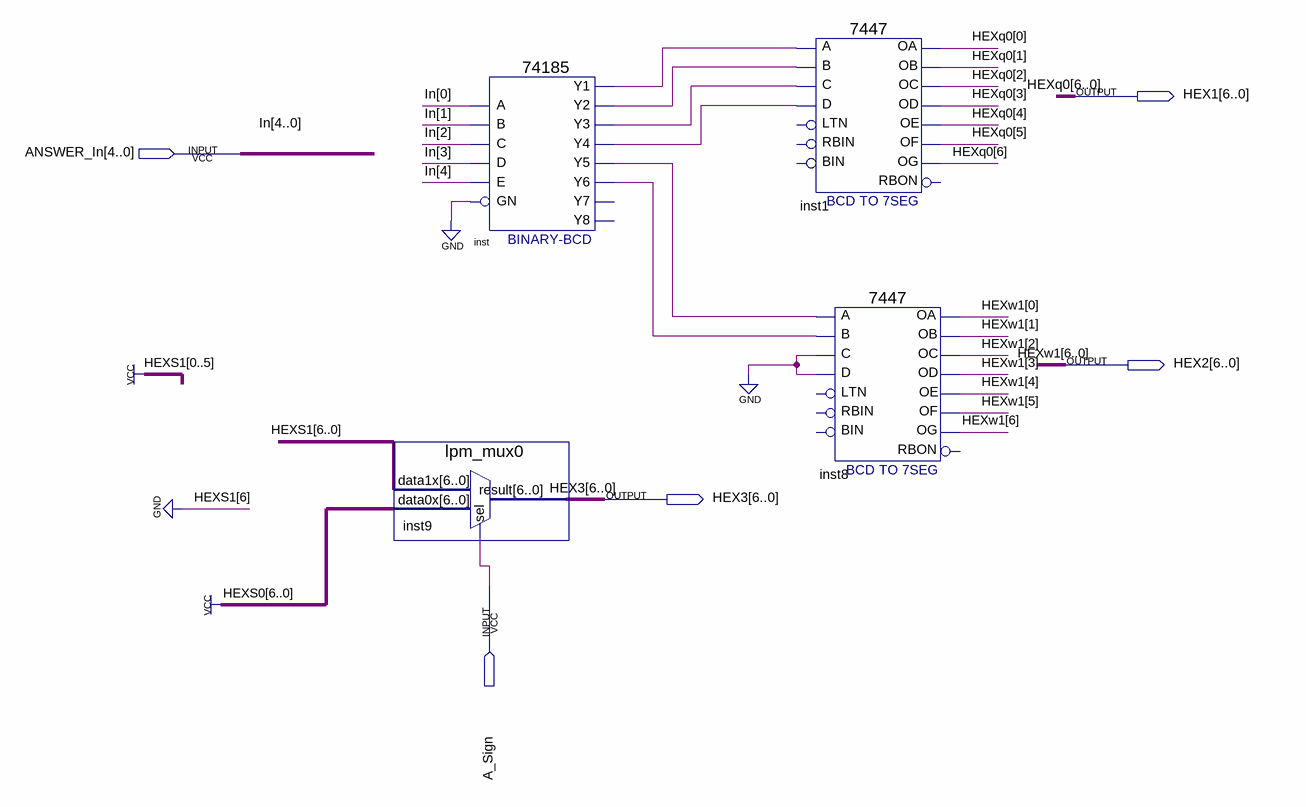
[diagram p0: schematic sheet]
// Quartus schematic DisplayAnswer.bdf as structural Verilog: 4 symbols, 5 pins
module DisplayAnswer (
  input  [4:0] ANSWER_In,
  input  A_Sign,
  output [6:0] HEX1,
  output [6:0] HEX2,
  output [6:0] HEX3
);

  wire inst_y1, inst_y2, inst_y3, inst_y4, inst_y5, inst_y6;

  lpm_mux0 inst9 (.data1x(7'b0111111), .data0x({7{1'b1}}), .sel(A_Sign), .result(HEX3));
  \74185  inst (
    .A(ANSWER_In[0]), .B(ANSWER_In[1]), .D(ANSWER_In[3]), .C(ANSWER_In[2]), .E(ANSWER_In[4]), .GN(1'b0),
    .Y1(inst_y1), .Y3(inst_y3), .Y2(inst_y2), .Y5(inst_y5), .Y4(inst_y4), .Y6(inst_y6));  // open: Y8, Y7
  \7447  inst1 (
    .B(inst_y2), .C(inst_y3), .D(inst_y4), .A(inst_y1), .OB(HEX1[1]), .OC(HEX1[2]), .OE(HEX1[4]),
    .OD(HEX1[3]), .OF(HEX1[5]), .OG(HEX1[6]), .OA(HEX1[0]));  // open: LTN, RBIN, BIN, RBON
  \7447  inst8 (
    .B(inst_y6), .C(1'b0), .D(1'b0), .A(inst_y5), .OB(HEX2[1]), .OC(HEX2[2]), .OE(HEX2[4]), .OD(HEX2[3]),
    .OF(HEX2[5]), .OG(HEX2[6]), .OA(HEX2[0]));  // open: LTN, RBIN, BIN, RBON

  // Other names for the same wires on the sheet: HEXq0[6:0] = HEX1; HEXw1[6:0] = HEX2; In[4:0] = ANSWER_In
endmodule
